# Altium schematic sheet Front_PowerConnectors.SchDoc: Front Power Connectors
size A4; CheckedBy: G.Kasprowicz; Author: M.Gaska; CompanyName: WUT ISE; DrawnBy: M.Gaska; Organization: WUT ISE; Address1: PW ISE; Address2: Nowowiejska 15/19 00-665 Warsaw; Address3: gkasprow@gmail.com; DocumentNumber: 9; SheetNumber: 9; SheetTotal: 9; ModifiedBy: M. Fafara; CheckedDate: -; Title2: v2.0; DivGrp: WUT ISE; Designer: M.Gaska; ModifiedDate: -; ProjectName: Sensor Box
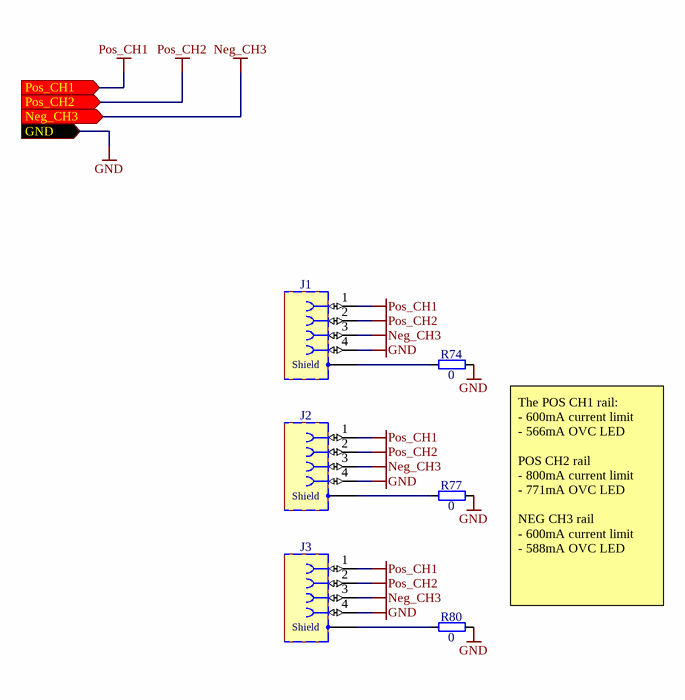
[diagram p0: Front_PowerConnectors.SchDoc]

## Parts
J1  M8  [AMPHENOL_M8AS-04PFFR-SF8001]  (value not drawn)
J2  M8  [AMPHENOL_M8AS-04PFFR-SF8001]  (value not drawn)
J3  M8  [AMPHENOL_M8AS-04PFFR-SF8001]  (value not drawn)
R74  0  [RESC1608X55N]
R77  0  [RESC1608X55N]
R80  0  [RESC1608X55N]

## Ports
GND (in), Neg_CH3 (in), Pos_CH1 (in), Pos_CH2 (in)

## Nets
GND: J1.4 J2.4 J3.4 R74.1 R77.1 R80.1 ; port GND
Neg_CH3: J1.3 J2.3 J3.3 ; port Neg_CH3
Pos_CH1: J1.1 J2.1 J3.1 ; port Pos_CH1
Pos_CH2: J1.2 J2.2 J3.2 ; port Pos_CH2
NetJ1_SHIELD: J1.SHIELD R74.2
NetJ2_SHIELD: J2.SHIELD R77.2
NetJ3_SHIELD: J3.SHIELD R80.2

## Notes on the sheet
- The POS CH1 rail:
  - 600mA current limit
  - 566mA OVC LED
  POS CH2 rail
  - 800mA current limit
  - 771mA OVC LED
  NEG CH3 rail
  - 600mA current limit
  - 588mA OVC LED
- Project/Equipment
- Document
- Designer
- Drawn by
- Check.by
- Copyright WUT ISE 2020.
  This documentation describes Open Hardware and is licensed under the CERN OHL v.1.2. You may redistribute and modify this documentation under the terms of the CERN OHL v.1.2. (http://ohwr.org/CERNOHL). This documentation is distributed WITHOUT ANY EXPRESS OR IMPLIED WARRANTY, INCLUDING OF MERCHANTABILITY, SATISFACTORY QUALITY AND FITNESS FOR A PARTICULAR PURPOSE. Please see the CERN OHL v.1.2 for applicable conditions.
- Contact
- File
- Last Mod.
- Print Date
- Sheet
- Size
- A3
- of
- Rev
- (in symbol AMPHENOL_M8AS-04PFFR-SF8001) Shield

## Library data of the parts
J1-J3 = AMPHENOL_M8AS-04PFFR-SF8001: Connector 4 Female + Shield; Part Description: 4 Contacts,  IP68 Sealing Level, Right Angled M8 Circular Receptacle; PressFit: No; Part Number: AMPHENOL_M8AS-04PFFR-SF8001; Component Kind: Standard; Component Type: Standard; Pin Count: 6; Family: M8; Mounted: Yes; Socket: No; SMD: No; Sense: No; Status: None; Manufacturer: AMPHENOL; Manufacturer Part Number: M8AS-04PFFR-SF8001; ComponentHeight: 12.65mm; HelpURL: \\cern.ch\dfs\Applications\Altium\Datasheets\AMPHENOL_M8AS-04PFFR-SF8001.pdf; Author: CERN DEM MR; CreateDate: 08.04.2019; LatestRevisionDate: 08.04.2019
R74 R77 R80 = R0603_0R_JUMPER: Resistor; Part Description: 1A (0.05R Max DC Resistance) Zero Ohm Jumper; Manufacturer: GENERIC; Manufacturer1 Part Number: NRC06Z0; PressFit: No; Part Number: R0603_0R_JUMPER; Component Kind: Standard; Component Type: Standard; Pin Count: 2; Value: 0; Status: Preferred; Manufacturer Part Number: R0603_0R_JUMPER; Case: 0603; Mounted: Yes; Sense: No; Socket: No; SMD: Yes; Manufacturer1 Example: NIC COMPONENT; Manufacturer1 ComponentHeight: 0.55mm; HelpURL: \\cern.ch\dfs\Applications\Altium\Datasheets\R0603_NIC_NRC.pdf; Author: CERN DEM JLC; CreateDate: 03.12.2007; LatestRevisionDate: 13.03.2008